# Altium project DARKYDEN.PrjPcb (part 3 of 9)

## Sheet WIFI.SchDoc: DARKYDEN_WIFI
size Letter; ApprovedBy: APPROUVÉ PAR; Author: Harold Malbrouck; Organization: Cegep Limoilou; Address1: 1300, 8e Avenue; Address2: Québec, QC; Address3: Canada; Address4: G1J 5L5; Revision: Rev.A; SheetNumber: 10; SheetTotal: 22
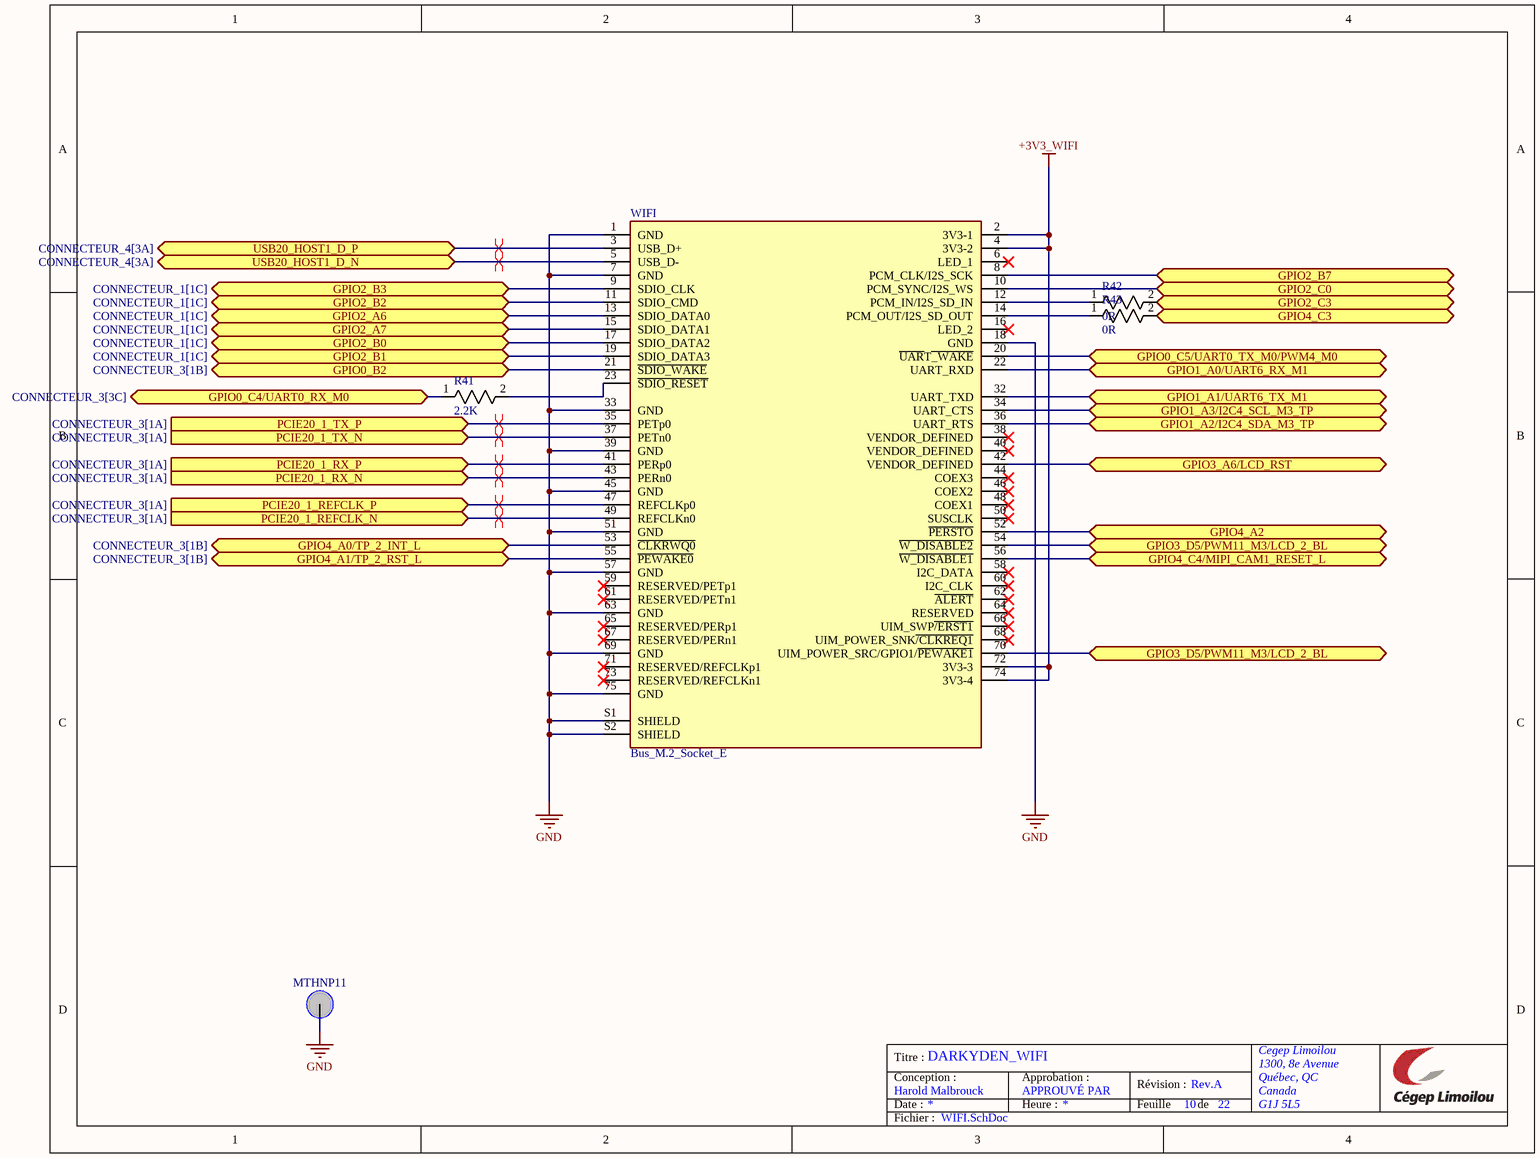
[diagram p3: WIFI.SchDoc]

### Parts
MTHNP11  Mounting Hole Non-Plated 3.2mm  [MTHNP3P2MM]  (value not drawn)
R41  2.2K  [RESC1608X55N]
R42  0R  [RESC1608X55N]
R43  0R  [RESC1608X55N]
WIFI  Bus_M.2_Socket_E  [AMPHENOL_MDT320E01001]

### Ports
GPIO0_B2 (bidir, see CONNECTEUR_3[1B]), GPIO0_C4/UART0_RX_M0 (bidir, see CONNECTEUR_3[3C]), GPIO0_C5/UART0_TX_M0/PWM4_M0 (bidir, see CONNECTEUR_3[3C]), GPIO1_A0/UART6_RX_M1 (bidir, see CONNECTEUR_3[1C]), GPIO1_A1/UART6_TX_M1 (bidir, see CONNECTEUR_3[1C]), GPIO1_A2/I2C4_SDA_M3_TP (bidir, see CONNECTEUR_3[1C]), GPIO1_A3/I2C4_SCL_M3_TP (bidir, see CONNECTEUR_3[1C]), GPIO2_A6 (bidir, see CONNECTEUR_1[1C]), GPIO2_A7 (bidir, see CONNECTEUR_1[1C]), GPIO2_B0 (bidir, see CONNECTEUR_1[1C]), GPIO2_B1 (bidir, see CONNECTEUR_1[1C]), GPIO2_B2 (bidir, see CONNECTEUR_1[1C]), GPIO2_B3 (bidir, see CONNECTEUR_1[1C]), GPIO2_B7 (bidir, see CONNECTEUR_1[1D]), GPIO2_C0 (bidir, see CONNECTEUR_1[1B]), GPIO2_C3 (bidir, see CONNECTEUR_1[1B]), GPIO3_A6/LCD_RST (bidir, see CONNECTEUR_4[1C]), GPIO3_D5/PWM11_M3/LCD_2_BL (bidir, see CONNECTEUR_4[1C], WIFI[3B]), GPIO3_D5/PWM11_M3/LCD_2_BL (bidir, see CONNECTEUR_4[1C], WIFI[3C]), GPIO4_A0/TP_2_INT_L (bidir, see CONNECTEUR_3[1B]), GPIO4_A1/TP_2_RST_L (bidir, see CONNECTEUR_3[1B]), GPIO4_A2 (bidir, see CONNECTEUR_3[1B]), GPIO4_C3 (bidir, see CONNECTEUR_1[3B]), GPIO4_C4/MIPI_CAM1_RESET_L (bidir, see CONNECTEUR_1[3B]), PCIE20_1_REFCLK_N (in, see CONNECTEUR_3[1A]), PCIE20_1_REFCLK_P (in, see CONNECTEUR_3[1A]), PCIE20_1_RX_N (in, see CONNECTEUR_3[1A]), PCIE20_1_RX_P (in, see CONNECTEUR_3[1A]), PCIE20_1_TX_N (in, see CONNECTEUR_3[1A]), PCIE20_1_TX_P (in, see CONNECTEUR_3[1A]), USB20_HOST1_D_N (bidir, see CONNECTEUR_4[3A]), USB20_HOST1_D_P (bidir, see CONNECTEUR_4[3A])

### Nets
+3V3_WIFI: WIFI.2(3V3-1) WIFI.4(3V3-2) WIFI.72(3V3-3) WIFI.74(3V3-4)
GND: MTHNP11.1 WIFI.1(GND) WIFI.7(GND) WIFI.18(GND) WIFI.33(GND) WIFI.39(GND) WIFI.45(GND) WIFI.51(GND) WIFI.57(GND) WIFI.63(GND) WIFI.69(GND) WIFI.75(GND) WIFI.S1(SHIELD) WIFI.S2(SHIELD)  [project net AGND]
GPIO0_B2: WIFI.21(~{SDIO_WAKE}) ; port GPIO0_B2
GPIO0_C4/UART0_RX_M0: R41.1 ; port GPIO0_C4/UART0_RX_M0
GPIO0_C5/UART0_TX_M0/PWM4_M0: WIFI.20(~{UAR}T~{_WAKE}) ; port GPIO0_C5/UART0_TX_M0/PWM4_M0
GPIO1_A0/UART6_RX_M1: WIFI.22(UART_RXD) ; port GPIO1_A0/UART6_RX_M1
GPIO1_A1/UART6_TX_M1: WIFI.32(UART_TXD) ; port GPIO1_A1/UART6_TX_M1
GPIO1_A2/I2C4_SDA_M3_TP: WIFI.36(UART_RTS) ; port GPIO1_A2/I2C4_SDA_M3_TP
GPIO1_A3/I2C4_SCL_M3_TP: WIFI.34(UART_CTS) ; port GPIO1_A3/I2C4_SCL_M3_TP
GPIO2_A6: WIFI.13(SDIO_DATA0) ; port GPIO2_A6
GPIO2_A7: WIFI.15(SDIO_DATA1) ; port GPIO2_A7
GPIO2_B0: WIFI.17(SDIO_DATA2) ; port GPIO2_B0
GPIO2_B1: WIFI.19(SDIO_DATA3) ; port GPIO2_B1
GPIO2_B2: WIFI.11(SDIO_CMD) ; port GPIO2_B2
GPIO2_B3: WIFI.9(SDIO_CLK) ; port GPIO2_B3
GPIO2_B7: WIFI.8(PCM_CLK/I2S_SCK) ; port GPIO2_B7
GPIO2_C0: WIFI.10(PCM_SYNC/I2S_WS) ; port GPIO2_C0
GPIO2_C3: R42.2 ; port GPIO2_C3
GPIO3_A6/LCD_RST: WIFI.42(VENDOR_DEFINED) ; port GPIO3_A6/LCD_RST
GPIO3_D5/PWM11_M3/LCD_2_BL: WIFI.54(~{W_DISABLE2}) WIFI.70(UIM_POWER_SRC/GPIO1/~{PEWAKE1}) ; port GPIO3_D5/PWM11_M3/LCD_2_BL
GPIO4_A0/TP_2_INT_L: WIFI.53(~{CLKRWQ0}) ; port GPIO4_A0/TP_2_INT_L
GPIO4_A1/TP_2_RST_L: WIFI.55(~{PEWAKE0}) ; port GPIO4_A1/TP_2_RST_L
GPIO4_A2: WIFI.52(~{PERSTO}) ; port GPIO4_A2
GPIO4_C3: R43.2 ; port GPIO4_C3
GPIO4_C4/MIPI_CAM1_RESET_L: WIFI.56(~{W_DISABLE1}) ; port GPIO4_C4/MIPI_CAM1_RESET_L
PCIE20_1_REFCLK_N: WIFI.49(REFCLKn0) ; port PCIE20_1_REFCLK_N
PCIE20_1_REFCLK_P: WIFI.47(REFCLKp0) ; port PCIE20_1_REFCLK_P
PCIE20_1_RX_N: WIFI.43(PERn0) ; port PCIE20_1_RX_N
PCIE20_1_RX_P: WIFI.41(PERp0) ; port PCIE20_1_RX_P
PCIE20_1_TX_N: WIFI.37(PETn0) ; port PCIE20_1_TX_N
PCIE20_1_TX_P: WIFI.35(PETp0) ; port PCIE20_1_TX_P
USB20_HOST1_D_N: WIFI.5(USB_D-) ; port USB20_HOST1_D_N
USB20_HOST1_D_P: WIFI.3(USB_D+) ; port USB20_HOST1_D_P
NetR41_2: R41.2 WIFI.23(~{SDIO_RESET})
NetR42_1: R42.1 WIFI.12(PCM_IN/I2S_SD_IN)
NetR43_1: R43.1 WIFI.14(PCM_OUT/I2S_SD_OUT)

Not connected (* = marked no-connect by the designer): WIFI 6(LED_1)* 16(LED_2)* 38(VENDOR_DEFINED)* 40(VENDOR_DEFINED)* 44(COEX3)* 46(COEX2)* 48(COEX1)* 50(SUSCLK)* 58(I2C_DATA)* 59(RESERVED/PETp1)* 60(I2C_CLK)* 61(RESERVED/PETn1)* 62(~{ALERT})* 64(RESERVED)* 65(RESERVED/PERp1)* 66(UIM_SWP~{/ERST1})* 67(RESERVED/PERn1)* 68(UIM_POWER_SNK~{/CLKREQ1})* 71(RESERVED/REFCLKp1)* 73(RESERVED/REFCLKn1)*

### Layout directives
differential pair: PCIE20_1_REFCLK_N, PCIE20_1_REFCLK_P, PCIE20_1_RX_N, PCIE20_1_RX_P, PCIE20_1_TX_N, PCIE20_1_TX_P, USB20_HOST1_D_N, USB20_HOST1_D_P

### Notes on the sheet
- Titre :
- Conception :
- Date :
- Approbation :
- Heure :
- Révision :
- Feuille
- de
- Fichier :

### Library data of the parts
MTHNP11 = MTHNP3P2MM: Mounting Hole Non-Plated 3.2mm drill hole
R41 = ERJ-3GEYJ222V: 2.2 kOhm, ï¿½ 5%, 100 mW, 0603 [1608 Metric], Thick Film, General Purpose; Manufacturer_Name: Panasonic; Value: 2.2kR; Power Rating: 100mW; Voltage Rating: 75V; Temperature Coefficient: 200ppm/°C; Voltage Rating (DC): 50V; Datasheet Link: http://docs-europe.electrocomponents.com/webdocs/13ba/0900766b813ba21b.pdf; Height: 0.55mm; Manufacturer_Part_Number: ERJ-3GEYJ222V; Mouser Part Number: 667-ERJ-3GEYJ222V; Mouser Price/Stock: https://www.mouser.co.uk/ProductDetail/Panasonic/ERJ-3GEYJ222V?qs=4WZYzuGhm5pzxkuuO4fqIg%3D%3D; Arrow Part Number: ERJ-3GEYJ222V; Arrow Price/Stock: https://www.arrow.com/en/products/erj-3geyj222v/panasonic?region=nac; Supplier: Digikey; Supplier Part Number: P2.2KGCT-ND; Manufacturer: Panasonic; Manufacturer Part Number: ERJ-3GEYJ222V; RoHS: Yes; Category: Chip SMD Resistors; Stock: 308618; Pricing: 1=0.1, 10=0.033, 50=0.02, 100=0.0165, 500=0.01096, 1000=0.00939 (USD); Mounting Technology: Surface Mount; Case/Package: 0603; Case Code (Imperial): 0603; Case Code (Metric): 1608; Contact Plating: Tin; Min Operating Temperature: -55°C; Max Operating Temperature: 155°C; Package Quantity: 1; Packaging: Tape and Reel; Tolerance: 5%; Resistor Type: Thick Film; Number of Terminations: 2; Termination: SMD/SMT; Max Power Dissipation: 100mW; Working Voltage: 75V; Features: Automotive AEC-Q200; Series: ERJ; Resistance Tolerance: 5%; Construction: Rectangular; Technology: THICK FILM; Length: 1.6mm; Width: 0.8mm; Depth: 0.8mm; Radiation Hardening: No; Reach SVHC Compliant: No; Military Standard: Not; Lead Free: Lead Free; RoHS Compliant: Yes; ComponentLink1URL: https://datasheet.ciiva.com/11821/0900766b80f806dd-11821453.pdf?src-supplier=Rs; ComponentLink1Description: https://datasheet.ciiva.com/11821/0900766b80f806dd-11821453.pdf?src-supplier=Rs; ComponentLink2URL: https://datasheet.ciiva.com/34303/1988639-34303614.pdf?src-supplier=Jameco; ComponentLink2Description: https://datasheet.ciiva.com/34303/1988639-34303614.pdf?src-supplier=Jameco; ComponentLink3URL: https://datasheet.ciiva.com/22758/1500035-22758223.pdf?src-supplier=Farnell; ComponentLink3Description: https://datasheet.ciiva.com/22758/1500035-22758223.pdf?src-supplier=Farnell; ComponentLink4URL: https://datasheet.ciiva.com/9117/aoa0000ce1-9117127.pdf?src-supplier=Avnet; ComponentLink4Description: https://datasheet.ciiva.com/9117/aoa0000ce1-9117127.pdf?src-supplier=Avnet; ComponentLink5URL: https://datasheet.ciiva.com/28584/1678796-28584095.pdf?src-supplier=Element14; ComponentLink5Description: https://datasheet.ciiva.com/28584/1678796-28584095.pdf?src-supplier=Element14; ComponentLink6URL: https://datasheet.ciiva.com/46380/1500035-46380411.pdf?src-supplier=Element14; ComponentLink6Description: https://datasheet.ciiva.com/46380/1500035-46380411.pdf?src-supplier=Element14; ComponentLink7URL: https://datasheet.ciiva.com/16760/70255313-16760341.pdf?src-supplier=Allied+Electronics; ComponentLink7Description: https://datasheet.ciiva.com/16760/70255313-16760341.pdf?src-supplier=Allied+Electronics; ComponentLink8URL: https://datasheet.ciiva.com/16765/70255313-16765244.pdf?src-supplier=Allied+Electronics; ComponentLink8Description: https://datasheet.ciiva.com/16765/70255313-16765244.pdf?src-supplier=Allied+Electronics; ComponentLink9URL: https://datasheet.ciiva.com/16199/aoa0000ce1-16199902.pdf?src-supplier=Future+Electronics; ComponentLink9Description: https://datasheet.ciiva.com/16199/aoa0000ce1-16199902.pdf?src-supplier=Future+Electronics
R42 R43 = ERJ-3GEY0R00V: Zero Ohm Resistor, Jumper, 0603 [1608 Metric], Thick Film, 100 mW, 1 A, Surface Mount; Manufacturer_Name: Panasonic; Power Rating: 100mW; Voltage Rating: 75V; Tolerance: 0%; Temperature Coefficient: 200ppm/°C; Datasheet Link: http://docs-europe.electrocomponents.com/webdocs/13ba/0900766b813ba21b.pdf; Height: 0.55mm; Manufacturer_Part_Number: ERJ-3GEY0R00V; Mouser Part Number: 667-ERJ-3GEY0R00V; Mouser Price/Stock: https://www.mouser.co.uk/ProductDetail/Panasonic/ERJ-3GEY0R00V?qs=66DK8nO8gJALIOqOWgiVwg%3D%3D; Arrow Part Number: ERJ-3GEY0R00V; Arrow Price/Stock: https://www.arrow.com/en/products/erj3gey0r00v/panasonic?region=europe; Supplier: Digikey; Supplier Part Number: P0.0GCT-ND; Manufacturer: Panasonic; Manufacturer Part Number: ERJ-3GEY0R00V; RoHS: Yes; Category: Chip SMD Resistors; Stock: 766631; Pricing: 1=0.1, 10=0.02, 25=0.0164, 50=0.0144, 100=0.0126, 250=0.0106, 500=0.00936, 1000=0.0083 (USD); Mounting Technology: Surface Mount; Case/Package: 0603; Case Code (Metric): 1608; Case Code (Imperial): 0603; Contact Plating: Tin; Min Operating Temperature: -55°C; Max Operating Temperature: 155°C; Packaging: Tape and Reel; Package Quantity: 5000; Value: 0R; Resistor Type: Thick Film; Number of Terminations: 2; Termination: SMD/SMT; Max Power Dissipation: 100mW; Features: Automotive AEC-Q200; Series: ERJ; Construction: Rectangular; Technology: THICK FILM; Length: 1.6mm; Width: 0.8mm; Depth: 0.8mm; Ratings: AEC-Q200; Radiation Hardening: No; Reach SVHC Compliant: No; Military Standard: Not; RoHS Compliant: Yes; Lead Free: 5697LeadFree; ComponentLink1URL: https://datasheet.ciiva.com/11808/0900766b80f806dd-11808207.pdf?src-supplier=Rs; ComponentLink1Description: https://datasheet.ciiva.com/11808/0900766b80f806dd-11808207.pdf?src-supplier=Rs; ComponentLink2URL: https://datasheet.ciiva.com/27055/1935748-27055113.pdf?src-supplier=Jameco; ComponentLink2Description: https://datasheet.ciiva.com/27055/1935748-27055113.pdf?src-supplier=Jameco; ComponentLink3URL: https://datasheet.ciiva.com/5959/1678796-5959707.pdf?src-supplier=Farnell; ComponentLink3Description: https://datasheet.ciiva.com/5959/1678796-5959707.pdf?src-supplier=Farnell; ComponentLink4URL: https://datasheet.ciiva.com/43460/1678796-43460647.pdf?src-supplier=Farnell; ComponentLink4Description: https://datasheet.ciiva.com/43460/1678796-43460647.pdf?src-supplier=Farnell; ComponentLink5URL: https://datasheet.ciiva.com/48532/aoa0000ce1-48532165.pdf?src-supplier=Avnet; ComponentLink5Description: https://datasheet.ciiva.com/48532/aoa0000ce1-48532165.pdf?src-supplier=Avnet; ComponentLink6URL: https://datasheet.ciiva.com/28695/1678796-28695833.pdf?src-supplier=Element14; ComponentLink6Description: https://datasheet.ciiva.com/28695/1678796-28695833.pdf?src-supplier=Element14; ComponentLink7URL: https://datasheet.ciiva.com/16834/aoa0000ce1-16834828.pdf?src-supplier=Future+Electronics; ComponentLink7Description: https://datasheet.ciiva.com/16834/aoa0000ce1-16834828.pdf?src-supplier=Future+Electronics; ComponentLink8URL: https://datasheet.ciiva.com/16758/70255313-16758527.pdf?src-supplier=Allied+Electronics; ComponentLink8Description: https://datasheet.ciiva.com/16758/70255313-16758527.pdf?src-supplier=Allied+Electronics; ComponentLink9URL: https://datasheet.ciiva.com/30199/4aoa0000ce1-30199822.pdf?src-supplier=Onlinecomponents.com; ComponentLink9Description: https://datasheet.ciiva.com/30199/4aoa0000ce1-30199822.pdf?src-supplier=Onlinecomponents.com; ComponentLink10URL: https://datasheet.ciiva.com/46377/1678796-46377868.pdf?src-supplier=Element14; ComponentLink10Description: https://datasheet.ciiva.com/46377/1678796-46377868.pdf?src-supplier=Element14; ComponentLink11URL: https://datasheet.ciiva.com/9198/aoa0000ce1-9198975.pdf?src-supplier=Avnet; ComponentLink11Description: https://datasheet.ciiva.com/9198/aoa0000ce1-9198975.pdf?src-supplier=Avnet
WIFI = Bus_M.2_Socket_E: PCIe M.2 Connectors, Storage and Server Connector, P=0.5mm, H=3.2mm, Key E,30Î¼in Au Plating; MP: MDT320E01001; MF: Amphenol ICC; Package: None; SnapEDA_Link: https://www.snapeda.com/parts/MDT320E01001/Amphenol+FCI/view-part/?ref=snap; Value: *; Purchase-URL: https://pricing.snapeda.com/search/part/MDT320E01001/?ref=eda; Check_prices: https://www.snapeda.com/parts/MDT320E01001/Amphenol+FCI/view-part/?ref=eda; Availability: In Stock; Price: None

## Sheet CONNECTEUR_2.SchDoc: DARKYDEN_CONNECTEUR_2
size Letter; ApprovedBy: APPROUVÉ PAR; Author: Harold Malbrouck; Organization: Cegep Limoilou; Address1: 1300, 8e Avenue; Address2: Québec, QC; Address3: Canada; Address4: G1J 5L5; Revision: Rev.B; SheetNumber: 12; SheetTotal: 22
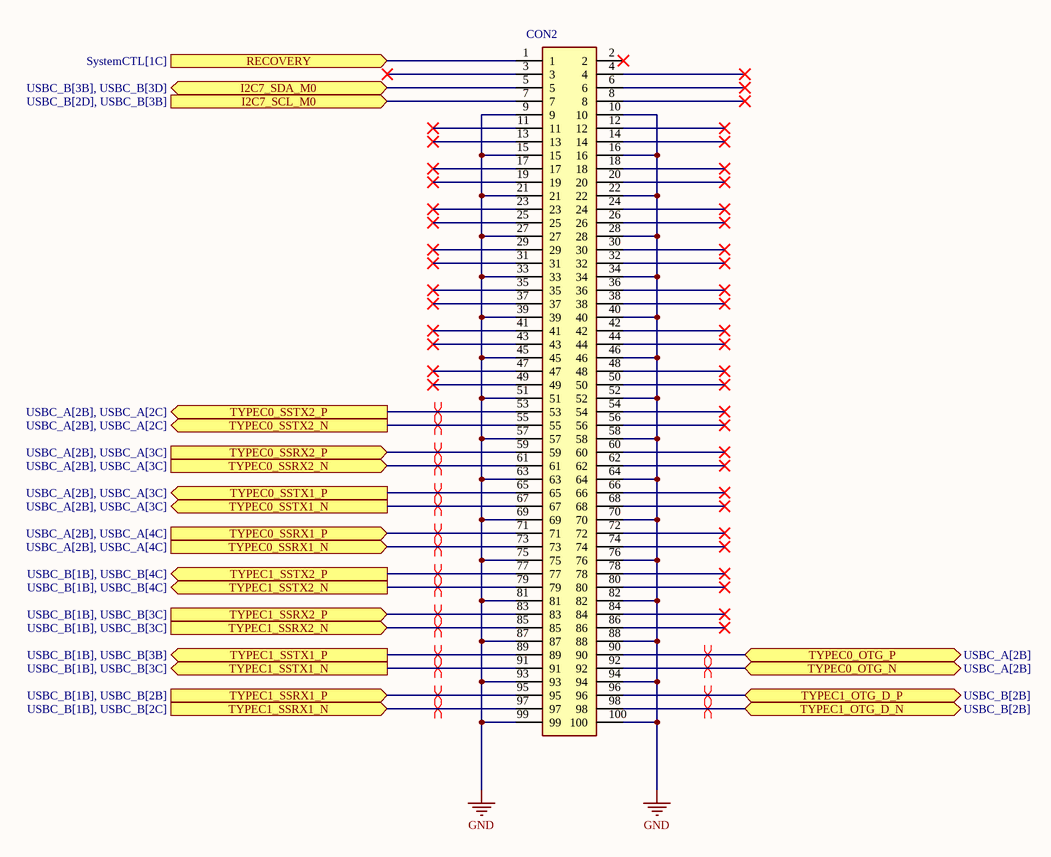
[diagram p4: CONNECTEUR_2.SchDoc]

### Parts
CON2  DF40HC  [DF40HC30100DS04V51_MOD]  (value not drawn)

### Ports
I2C7_SCL_M0 (in, see USBC_B[2D], USBC_B[3B]), I2C7_SDA_M0 (bidir, see USBC_B[3B], USBC_B[3D]), RECOVERY (in, see SystemCTL[1C]), TYPEC0_OTG_N (bidir, see USBC_A[2B]), TYPEC0_OTG_P (bidir, see USBC_A[2B]), TYPEC0_SSRX1_N (in, see USBC_A[2B], USBC_A[4C]), TYPEC0_SSRX1_P (in, see USBC_A[2B], USBC_A[4C]), TYPEC0_SSRX2_N (in, see USBC_A[2B], USBC_A[3C]), TYPEC0_SSRX2_P (in, see USBC_A[2B], USBC_A[3C]), TYPEC0_SSTX1_N (out, see USBC_A[2B], USBC_A[3C]), TYPEC0_SSTX1_P (out, see USBC_A[2B], USBC_A[3C]), TYPEC0_SSTX2_N (out, see USBC_A[2B], USBC_A[2C]), TYPEC0_SSTX2_P (out, see USBC_A[2B], USBC_A[2C]), TYPEC1_OTG_D_N (bidir, see USBC_B[2B]), TYPEC1_OTG_D_P (bidir, see USBC_B[2B]), TYPEC1_SSRX1_N (in, see USBC_B[1B], USBC_B[2C]), TYPEC1_SSRX1_P (in, see USBC_B[1B], USBC_B[2B]), TYPEC1_SSRX2_N (in, see USBC_B[1B], USBC_B[3C]), TYPEC1_SSRX2_P (in, see USBC_B[1B], USBC_B[3C]), TYPEC1_SSTX1_N (out, see USBC_B[1B], USBC_B[3C]), TYPEC1_SSTX1_P (out, see USBC_B[1B], USBC_B[3B]), TYPEC1_SSTX2_N (out, see USBC_B[1B], USBC_B[4C]), TYPEC1_SSTX2_P (out, see USBC_B[1B], USBC_B[4C])

### Nets
GND: CON2.9 CON2.10 CON2.15 CON2.16 CON2.21 CON2.22 CON2.27 CON2.28 CON2.33 CON2.34 CON2.39 CON2.40 CON2.45 CON2.46 CON2.51 CON2.52 CON2.57 CON2.58 CON2.63 CON2.64 CON2.69 CON2.70 CON2.75 CON2.76 CON2.81 CON2.82 CON2.87 CON2.88 CON2.93 CON2.94 CON2.99 CON2.100  [project net AGND]
I2C7_SCL_M0: CON2.7 ; port I2C7_SCL_M0
I2C7_SDA_M0: CON2.5 ; port I2C7_SDA_M0
RECOVERY: CON2.1 ; port RECOVERY
TYPEC0_OTG_N: CON2.92 ; port TYPEC0_OTG_N
TYPEC0_OTG_P: CON2.90 ; port TYPEC0_OTG_P
TYPEC0_SSRX1_N: CON2.73 ; port TYPEC0_SSRX1_N
TYPEC0_SSRX1_P: CON2.71 ; port TYPEC0_SSRX1_P
TYPEC0_SSRX2_N: CON2.61 ; port TYPEC0_SSRX2_N
TYPEC0_SSRX2_P: CON2.59 ; port TYPEC0_SSRX2_P
TYPEC0_SSTX1_N: CON2.67 ; port TYPEC0_SSTX1_N
TYPEC0_SSTX1_P: CON2.65 ; port TYPEC0_SSTX1_P
TYPEC0_SSTX2_N: CON2.55 ; port TYPEC0_SSTX2_N
TYPEC0_SSTX2_P: CON2.53 ; port TYPEC0_SSTX2_P
TYPEC1_OTG_D_N: CON2.98 ; port TYPEC1_OTG_D_N
TYPEC1_OTG_D_P: CON2.96 ; port TYPEC1_OTG_D_P
TYPEC1_SSRX1_N: CON2.97 ; port TYPEC1_SSRX1_N
TYPEC1_SSRX1_P: CON2.95 ; port TYPEC1_SSRX1_P
TYPEC1_SSRX2_N: CON2.85 ; port TYPEC1_SSRX2_N
TYPEC1_SSRX2_P: CON2.83 ; port TYPEC1_SSRX2_P
TYPEC1_SSTX1_N: CON2.91 ; port TYPEC1_SSTX1_N
TYPEC1_SSTX1_P: CON2.89 ; port TYPEC1_SSTX1_P
TYPEC1_SSTX2_N: CON2.79 ; port TYPEC1_SSTX2_N
TYPEC1_SSTX2_P: CON2.77 ; port TYPEC1_SSTX2_P

Not connected (* = marked no-connect by the designer): CON2 2* 3* 4* 6* 8* 11* 12* 13* 14* 17* 18* 19* 20* 23* 24* 25* 26* 29* 30* 31* 32* 35* 36* 37* 38* 41* 42* 43* 44* 47* 48* 49* 50* 54* 56* 60* 62* 66* 68* 72* 74* 78* 80* 84* 86*

### Layout directives
differential pair: TYPEC0_OTG_N, TYPEC0_OTG_P, TYPEC0_SSRX1_N, TYPEC0_SSRX1_P, TYPEC0_SSRX2_N, TYPEC0_SSRX2_P, TYPEC0_SSTX1_N, TYPEC0_SSTX1_P, TYPEC0_SSTX2_N, TYPEC0_SSTX2_P, TYPEC1_OTG_D_N, TYPEC1_OTG_D_P, TYPEC1_SSRX1_N, TYPEC1_SSRX1_P, TYPEC1_SSRX2_N, TYPEC1_SSRX2_P, TYPEC1_SSTX1_N, TYPEC1_SSTX1_P, TYPEC1_SSTX2_N, TYPEC1_SSTX2_P

### Notes on the sheet
- Titre :
- Conception :
- Date :
- Approbation :
- Heure :
- Révision :
- Feuille
- de
- Fichier :

### Library data of the parts
CON2 = DF40HC(3.0)-100DS-0.4V(51): Stacking Board Connector, DF40 Series, Receptacle, 0.4 mm, 100, Surface Mount, G; Manufacturer_Name: Hirose; Number of Positions: 100; Contact Resistance: 90mR; Contact Voltage Rating (AC): 30V; Current Rating: 300mA; Mated Stacking Heights: 3mm; Contact Pitch: 400um; Datasheet Link: https://componentsearchengine.com/Datasheets/1/DF40HC(3.0)-100DS-0.4V(51.pdf; Height: 3.05mm; Manufacturer_Part_Number: DF40HC(3.0)-100DS-0.4V(51; Mouser Part Number: 798-DF40HC30100DS451; Mouser Price/Stock: https://www.mouser.co.uk/ProductDetail/Hirose-Connector/DF40HC3.0-100DS-0.4V51?qs=%252BAZVS4b%2FkgIV%252B3vHYy2dCA%3D%3D; Arrow Part Number: DF40HC(3.0)-100DS-0.4V(51; Arrow Price/Stock: https://www.arrow.com/en/products/df40hc-3.0-100ds-0.4v-51/hirose-electric; Supplier: Digikey; Supplier Part Number: 26-DF40HC(3.0)-100DS-0.4V(51)CT-ND; Manufacturer: Hirose; Manufacturer Part Number: DF40HC(3.0)-100DS-0.4V(51; RoHS: Yes; Category: Headers and Wire Housings; Stock: 5604; Pricing: 1=2.61, 10=2.219, 25=2.0796, 50=1.9804, 100=1.8858, 250=1.76764, 500=1.68326, 1000=1.6524 (USD); Mounting Technology: Surface Mount; Contact Plating: Gold; Contact Material: Nickel,Gold; Housing Color: Black; Min Operating Temperature: -35°C; Max Operating Temperature: 85°C; Package Quantity: 3000; Packaging: Tape and Reel; Number of Rows: 2; Connector Type: Receptacle; Series: DF40; Contact Voltage Rating (DC): 30V; Number of Contacts: 100; Orientation: Straight; Voltage Rating: 30V; Length: 22.6mm; Width: 3.38mm; ComponentLink1URL: https://datasheet.ciiva.com/13559/ed-df40-20140305-13559540.pdf?src-supplier=Mouser; ComponentLink1Description: https://datasheet.ciiva.com/13559/ed-df40-20140305-13559540.pdf?src-supplier=Mouser

## Sheet eDP.SchDoc: DARKYDEN_eDP
size Letter; ApprovedBy: APPROUVÉ PAR; Author: Harold Malbrouck; Organization: Cegep Limoilou; Address1: 1300, 8e Avenue; Address2: Québec, QC; Address3: Canada; Address4: G1J 5L5; Revision: Rev.A; SheetNumber: 15; SheetTotal: 22
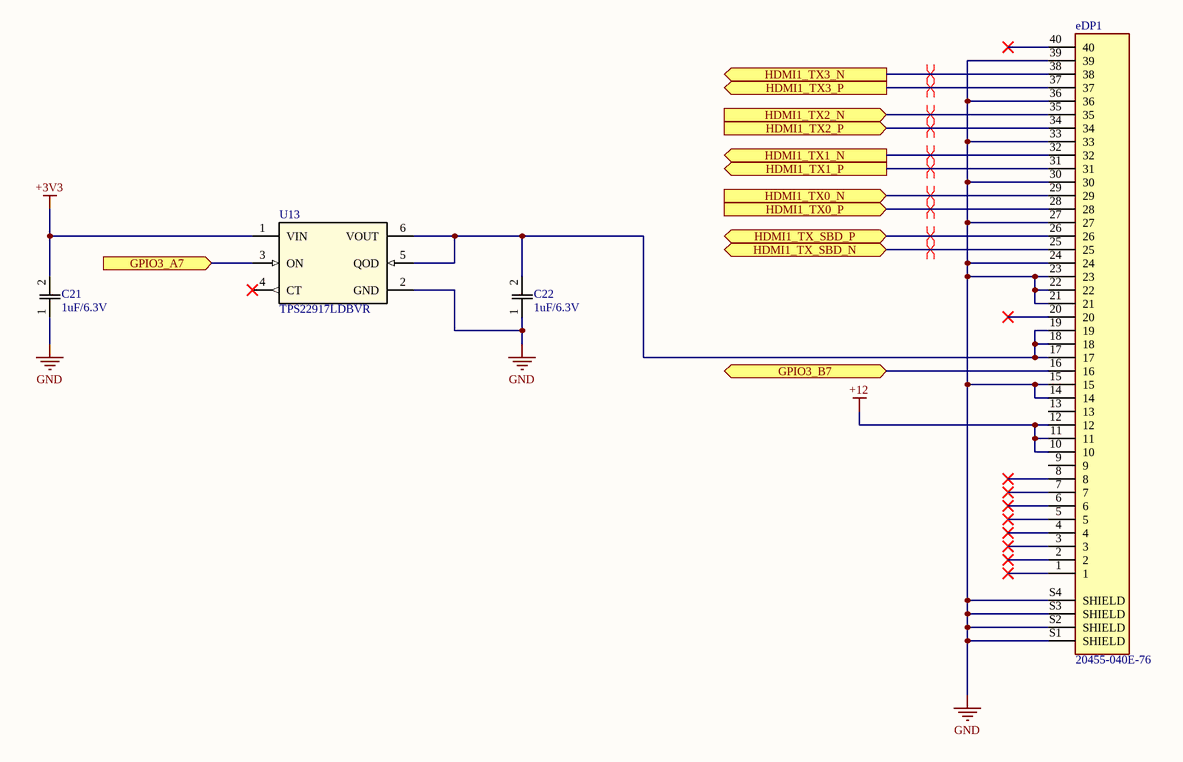
[diagram p5: eDP.SchDoc]

### Parts
C21  1uF/6.3V  [C0805]
C22  1uF/6.3V  [C0805]
eDP1  20455-040E-76  [IPEX_20455-040E-76]
U13  TPS22917LDBVR  [DBV0006_L]

### Ports
GPIO3_A7 (in, see CONNECTEUR_4[3C]), GPIO3_B7 (bidir, see CONNECTEUR_4[3C]), HDMI1_TX0_N (in, see CONNECTEUR_4[1A]), HDMI1_TX0_P (in, see CONNECTEUR_4[1A]), HDMI1_TX1_N (out, see CONNECTEUR_4[1A]), HDMI1_TX1_P (out, see CONNECTEUR_4[1A]), HDMI1_TX2_N (in, see CONNECTEUR_4[1A]), HDMI1_TX2_P (in, see CONNECTEUR_4[1A]), HDMI1_TX3_N (out, see CONNECTEUR_4[1A]), HDMI1_TX3_P (out, see CONNECTEUR_4[1A]), HDMI1_TX_SBD_N (bidir, see CONNECTEUR_4[1B]), HDMI1_TX_SBD_P (bidir, see CONNECTEUR_4[1B])

### Nets
+3V3: C21.2 U13.1(VIN)
+12: eDP1.10 eDP1.11 eDP1.12
GND: C21.1 C22.1 eDP1.14 eDP1.15 eDP1.21 eDP1.22 eDP1.23 eDP1.24 eDP1.27 eDP1.30 eDP1.33 eDP1.36 eDP1.39 eDP1.S1(SHIELD) eDP1.S2(SHIELD) eDP1.S3(SHIELD) eDP1.S4(SHIELD) U13.2(GND)  [project net AGND]
GPIO3_A7: U13.3(ON) ; port GPIO3_A7
GPIO3_B7: eDP1.16 ; port GPIO3_B7
HDMI1_TX0_N: eDP1.29 ; port HDMI1_TX0_N
HDMI1_TX0_P: eDP1.28 ; port HDMI1_TX0_P
HDMI1_TX1_N: eDP1.32 ; port HDMI1_TX1_N
HDMI1_TX1_P: eDP1.31 ; port HDMI1_TX1_P
HDMI1_TX2_N: eDP1.35 ; port HDMI1_TX2_N
HDMI1_TX2_P: eDP1.34 ; port HDMI1_TX2_P
HDMI1_TX3_N: eDP1.38 ; port HDMI1_TX3_N
HDMI1_TX3_P: eDP1.37 ; port HDMI1_TX3_P
HDMI1_TX_SBD_N: eDP1.25 ; port HDMI1_TX_SBD_N
HDMI1_TX_SBD_P: eDP1.26 ; port HDMI1_TX_SBD_P
NetC22_2: C22.2 eDP1.17 eDP1.18 eDP1.19 U13.5(QOD) U13.6(VOUT)

Not connected (* = marked no-connect by the designer): eDP1 1* 2* 3* 4* 5* 6* 7* 8* 9 13 20* 40*; U13 4(CT)*

### Layout directives
differential pair: HDMI1_TX0_N, HDMI1_TX0_P, HDMI1_TX1_N, HDMI1_TX1_P, HDMI1_TX2_N, HDMI1_TX2_P, HDMI1_TX3_N, HDMI1_TX3_P, HDMI1_TX_SBD_N, HDMI1_TX_SBD_P

### Notes on the sheet
- Titre :
- Conception :
- Date :
- Approbation :
- Heure :
- Révision :
- Feuille
- de
- Fichier :

### Library data of the parts
C21 C22 = C0805C105K9RACTU: 1 uF, 6.3 V, ± 10%, X7R, 0805 [2012 Metric] Multilayer Ceramic Capacitor,; Manufacturer_Name: KEMET; Value: 1uF; Voltage Rating: 6.3V; Datasheet Link: https://content.kemet.com/datasheets/KEM_C1002_X7R_SMD.pdf; Height: 1.1mm; Manufacturer_Part_Number: C0805C105K9RACTU; Mouser Part Number: 80-C0805C105K9R; Mouser Price/Stock: https://www.mouser.co.uk/ProductDetail/KEMET/C0805C105K9RACTU?qs=Nnkldhwoc36daYb4WU%2Fecw%3D%3D; Arrow Part Number: C0805C105K9RACTU; Arrow Price/Stock: https://www.arrow.com/en/products/c0805c105k9ractu/kemet-corporation?utm_currency=USD&region=nac; Supplier: Digikey; Supplier Part Number: 399-13161-1-ND; Manufacturer: KEMET; Manufacturer Part Number: C0805C105K9RACTU; RoHS: Yes; Category: Ceramic Capacitors; Stock: 8847; Pricing: 1=0.49, 10=0.397, 100=0.3017, 1000=0.24335, 2500=0.22102, 5000=0.20619, 7500=0.16784, 12500=0.12939, 17500=0.02492, 25000=0.02414, 62500=0.02244, 125000=0.02142, 250000=0.02059 (USD); Mounting Technology: Surface Mount; Case/Package: 0805; Case Code (Metric): 2012; Case Code (Imperial): 0805; Dielectric Material: Ceramic; Min Operating Temperature: -55°C; Max Operating Temperature: 125°C; Packaging: Tape and Reel; Tolerance: 10%; Package Quantity: 4000; Voltage Rating (DC): 6.3V; Dielectric: X7R; Termination: SMD/SMT; Series: C0805C; Construction: Flat; Length: 2mm; Width: 1.2mm; Thickness: 0.039inch; Lead Pitch: 0.75mm; Depth: 1.25mm; Radiation Hardening: No; RoHS Compliant: Yes; ComponentLink1URL: https://datasheet.ciiva.com/5416/kem-c1002-x7r-smd-5416463.pdf?src-supplier=Mouser; ComponentLink1Description: https://datasheet.ciiva.com/5416/kem-c1002-x7r-smd-5416463.pdf?src-supplier=Mouser
eDP1 = 20455-040E-76: Conn Wire to Board RCP 40 POS 0.5mm Solder RA Side Entry SMDCABLINE® T/R; Manufacturer: I-PEX; Package: None; Price: None; Value: *; MP: 20455-040E-76; Availability: Unavailable; Supplier: Digikey; Supplier Part Number: 5378-20455-040E-76CT-ND; Manufacturer Part Number: 20455-040E-76; RoHS: No; Category: FFC / FPC; Stock: 7447; Pricing: 1=2.21, 10=1.878, 25=1.7604, 50=1.6764, 100=1.5962, 250=1.49624, 500=1.4248, 1000=1.377 (USD); RoHS Compliant: No; ComponentLink1URL: https://datasheet.octopart.com/20455-040E-76-I-PEX-datasheet-154856138.pdf?src-supplier=Future+Electronics; ComponentLink1Description: https://datasheet.octopart.com/20455-040E-76-I-PEX-datasheet-154856138.pdf?src-supplier=Future+Electronics; ComponentLink2URL: http://datasheet.octopart.com/20455-040E-76-I-PEX-datasheet-154856138.pdf?src-supplier=Quest; ComponentLink2Description: http://datasheet.octopart.com/20455-040E-76-I-PEX-datasheet-154856138.pdf?src-supplier=Quest
U13 = TPS22917LDBVR: 5.5-V, 2-A, 80-mΩ , 10-nA leakage load switch adj. rise time and adj output discharge 6-SOT-23 -45 to 125; Mfr_Name: Texas Instruments; TYPE: TYPE; RefDes: RefDes; Supplier: Digikey; Supplier Part Number: 296-TPS22917LDBVRCT-ND; Manufacturer: Texas Instruments; Manufacturer Part Number: TPS22917LDBVR; RoHS: No; Category: Integrated Circuits (ICs); Stock: 10229; Pricing: 1=0.41, 10=0.284, 25=0.2528, 100=0.2188, 250=0.20248, 500=0.1927, 1000=0.18463 (USD); Case/Package: 926Case; Pins: 6NUMBER; Length: 2.9mm; Width: 1.6mm; Thickness: 1.2mm

## Sheet POWERSYSTEM.SchDoc: DARKYDEN_POWERSYSTEM
size Letter; ApprovedBy: APPROUVÉ PAR; Author: Harold Malbrouck; Organization: Cegep Limoilou; Address1: 1300, 8e Avenue; Address2: Québec, QC; Address3: Canada; Address4: G1J 5L5; Revision: Rev.A; SheetNumber: 16; SheetTotal: 22
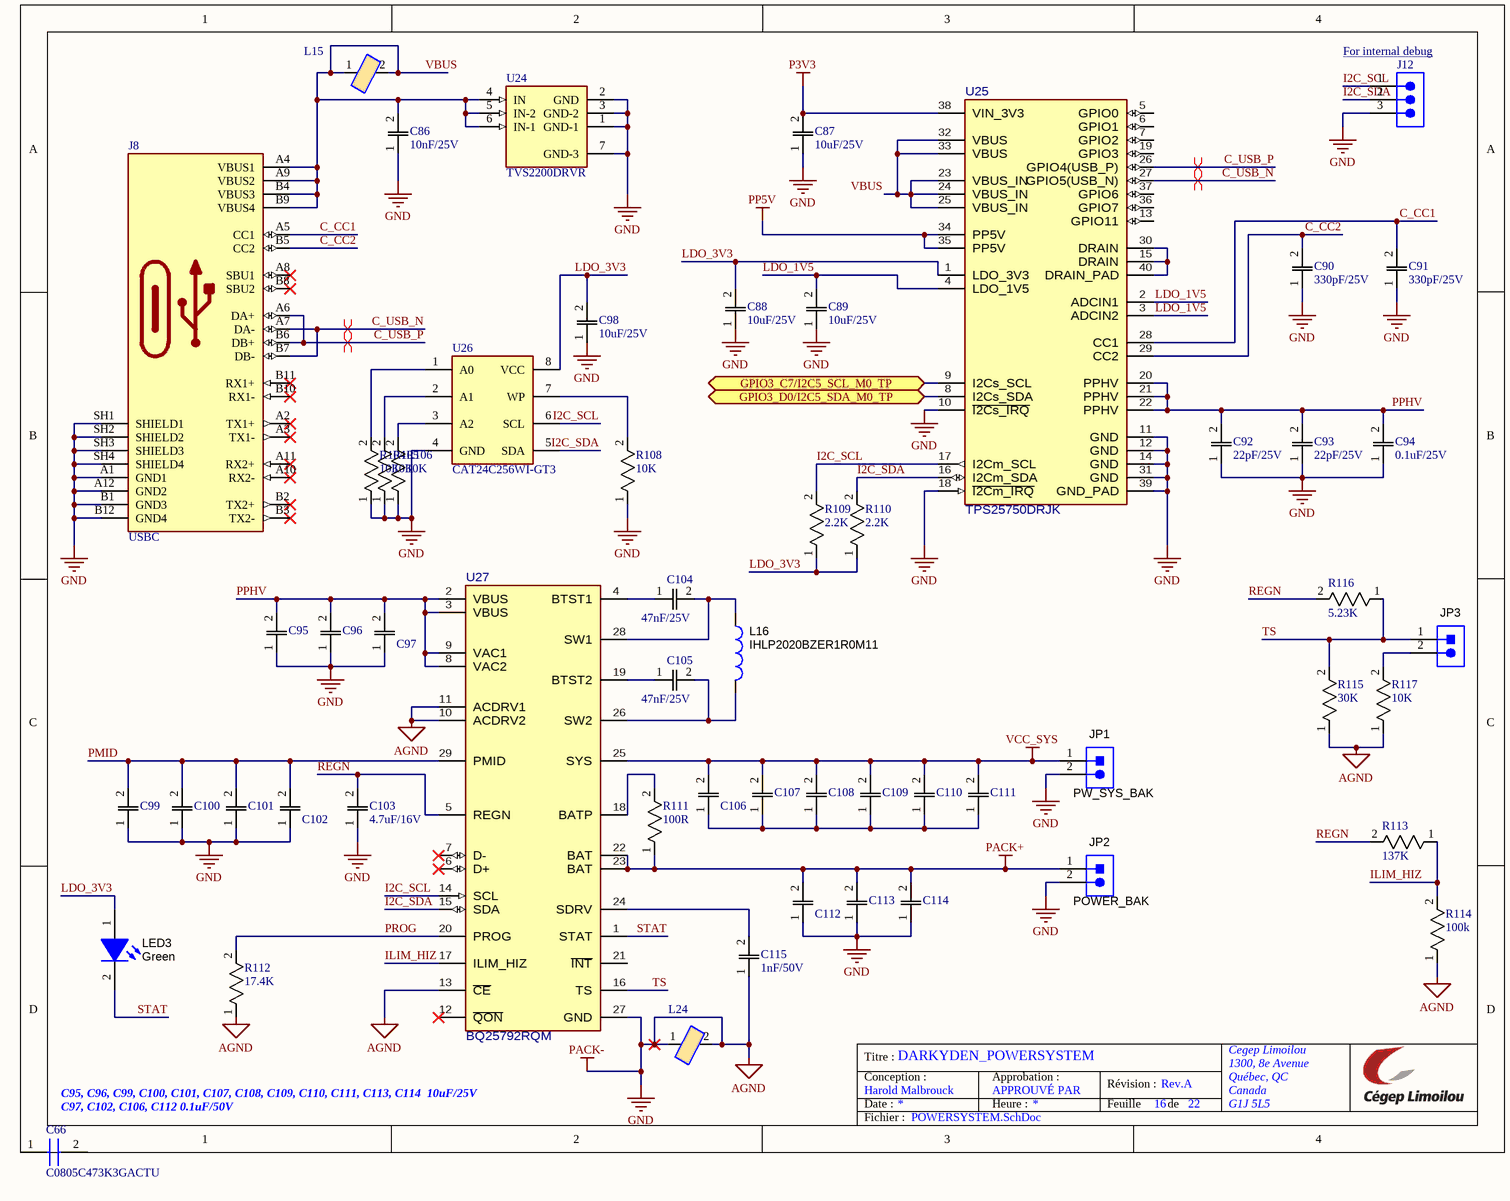
[diagram p6: POWERSYSTEM.SchDoc]

### Parts
C66  C0805C473K3GACTU  [C0805]
C86  10nF/25V  [C0805]
C87  10uF/25V  [C0805]
C88  10uF/25V  [C0805]
C89  10uF/25V  [C0805]
C90  330pF/25V  [C0805]
C91  330pF/25V  [C0805]
C92  22pF/25V  [c0805]
C93  22pF/25V  [c0805]
C94  0.1uF/25V  [c0805]
C95  10uF/25V  [C0805]  (value not drawn)
C96  10uF/25V  [C0805]  (value not drawn)
C97  0.1uF/50V  [C0805]  (value not drawn)
C98  10uF/25V  [C0805]
C99  10uF/25V  [C0805]  (value not drawn)
C100  10uF/25V  [C0805]  (value not drawn)
C101  10uF/25V  [C0805]  (value not drawn)
C102  0.1uF/50V  [C0805]  (value not drawn)
C103  4.7uF/16V  [C0805]
C104  47nF/25V  [C0805]
C105  47nF/25V  [C0805]
C106  0.1uF/50V  [C0805]  (value not drawn)
C107  10uF/25V  [C0805]  (value not drawn)
C108  10uF/25V  [C0805]  (value not drawn)
C109  10uF/25V  [C0805]  (value not drawn)
C110  10uF/25V  [C0805]  (value not drawn)
C111  10uF/25V  [C0805]  (value not drawn)
C112  0.1uF/50V  [C0805]  (value not drawn)
C113  10uF/25V  [C0805]  (value not drawn)
C114  10uF/25V  [C0805]  (value not drawn)
C115  1nF/50V  [C0805]
J8  USBC  [USB_C]
J12  61300311121  [61300311121]  (value not drawn)
JP1  PW_SYS_BAK  [61300211121]
JP2  POWER_BAK  [61300211121]
JP3  TS  [61300211121]  (value not drawn)
L15  FBMJ2125HM210NT  [INDC2012X105N]  (value not drawn)
L16  IHLP2020BZER1R0M11  [IHLP-2020BZ]
L24  FBMJ2125HM210NT  [INDC2012X105N]  (value not drawn)
LED3  value Green  [LED_LTST-C190]  (hidden comment: LTST-C190GKT)
R104  10K  [RESC1608X55N]
R105  10K  [RESC1608X55N]
R106  10K  [RESC1608X55N]
R108  10K  [RESC1608X55N]
R109  2.2K  [RESC1608X55N]
R110  2.2K  [RESC1608X55N]
R111  100R  [RESC1608X55N]
R112  17.4K  [RESC1608X55N]
R113  137K  [RESC1608X55N]
R114  100k  [RESC1608X55N]
R115  30K  [RESC1608X55N]
R116  5.23K  [RESC1608X55N]
R117  10K  [RESC1608X55N]
U24  TVS2200DRVR  [SON65P200X200X80-7N]
U25  TPS25750DRJK  [RJK0038B-C01-MFG]
U26  CAT24C256WI-GT3  [SOIC127P600X175-8N]
U27  BQ25792RQM  [RQM0029A-MFG]

### Ports
GPIO3_C7/I2C5_SCL_M0_TP (bidir, see CONNECTEUR_4[1C]), GPIO3_D0/I2C5_SDA_M0_TP (bidir, see CONNECTEUR_4[1C])

### Nets
AGND: C86.1 C87.1 C88.1 C89.1 C90.1 C91.1 C92.1 C93.1 C94.1 C95.1 C96.1 C97.1 C98.1 C99.1 C100.1 C101.1 C102.1 C103.1 C112.1 C113.1 C114.1 C115.1 J8.A1(GND1) J8.A12(GND2) J8.B1(GND3) J8.B12(GND4) J8.SH1(SHIELD1) J8.SH2(SHIELD2) J8.SH3(SHIELD3) J8.SH4(SHIELD4) J12.3 JP1.2 JP2.2 L24.1 L24.2 R104.1 R105.1 R106.1 R108.1 R112.1 R114.1 R115.1 R117.1 U24.1(GND-1) U24.2(GND) U24.3(GND-2) U24.7(GND-3) U25.10(~{I2Cs_IRQ}) U25.11(GND) U25.12(GND) U25.14(GND) U25.18(~{I2Cm_IRQ}) U25.31(GND) U25.39(GND_PAD) U26.4(GND) U27.10(ACDRV2) U27.11(ACDRV1) U27.13(~{CE}) U27.27(GND)  [also labelled GND, PACK-]
P3V3: C87.2 U25.38(VIN_3V3)
PACK+: C112.2 C113.2 C114.2 JP2.1 R111.1 U27.22(BAT) U27.23(BAT)
PP5V: U25.34(PP5V) U25.35(PP5V)
VCC_SYS: C106.2 C107.2 C108.2 C109.2 C110.2 C111.2 JP1.1 U27.25(SYS)
C_CC1: C91.2 J8.A5(CC1) U25.28(CC1)
C_CC2: C90.2 J8.B5(CC2) U25.29(CC2)
C_USB_N: J8.A7(DA-) J8.B7(DB-) U25.27(GPIO5(USB_N))
C_USB_P: J8.A6(DA+) J8.B6(DB+) U25.26(GPIO4(USB_P))
GPIO3_C7/I2C5_SCL_M0_TP: U25.9(I2Cs_SCL) ; port GPIO3_C7/I2C5_SCL_M0_TP
GPIO3_D0/I2C5_SDA_M0_TP: U25.8(I2Cs_SDA) ; port GPIO3_D0/I2C5_SDA_M0_TP
I2C_SCL: J12.1 R109.2 U25.17(I2Cm_SCL) U26.6(SCL) U27.14(SCL)
I2C_SDA: J12.2 R110.2 U25.16(I2Cm_SDA) U26.5(SDA) U27.15(SDA)
ILIM_HIZ: R113.1 R114.2 U27.17(ILIM_HIZ)
LDO_1V5: C89.2 U25.2(ADCIN1) U25.3(ADCIN2) U25.4(LDO_1V5)
LDO_3V3: C88.2 C98.2 LED3.1(A) R109.1 R110.1 U25.1(LDO_3V3) U26.8(VCC)
PMID: C99.2 C100.2 C101.2 C102.2 U27.29(PMID)
PPHV: C92.2 C93.2 C94.2 C95.2 C96.2 C97.2 U25.20(PPHV) U25.21(PPHV) U25.22(PPHV) U27.2(VBUS) U27.3(VBUS) U27.8(VAC2) U27.9(VAC1)
PROG: R112.2 U27.20(PROG)
REGN: C103.2 R113.2 R116.2 U27.5(REGN)
STAT: LED3.2(K) U27.1(STAT)
TS: JP3.1 R115.2 R116.1 U27.16(TS)
VBUS: C86.2 J8.A4(VBUS1) J8.A9(VBUS2) J8.B4(VBUS3) J8.B9(VBUS4) L15.1 L15.2 U24.4(IN) U24.5(IN-2) U24.6(IN-1) U25.23(VBUS_IN) U25.24(VBUS_IN) U25.25(VBUS_IN) U25.32(VBUS) U25.33(VBUS)
NetC104_1: C104.1 U27.4(BTST1)
NetC104_2: C104.2 L16.1 U27.28(SW1)
NetC105_1: C105.1 U27.19(BTST2)
NetC105_2: C105.2 L16.2 U27.26(SW2)
NetC106_1: C106.1 C107.1 C108.1 C109.1 C110.1 C111.1
NetC115_2: C115.2 U27.24(SDRV)
NetJP3_2: JP3.2 R117.2
NetR104_2: R104.2 U26.1(A0)
NetR105_2: R105.2 U26.2(A1)
NetR106_2: R106.2 U26.3(A2)
NetR108_2: R108.2 U26.7(WP)
NetR111_2: R111.2 U27.18(BATP)
NetU25_15: U25.15(DRAIN) U25.30(DRAIN) U25.40(DRAIN_PAD)

Not connected (* = marked no-connect by the designer): C66 1 2; J8 A2(TX1+)* A3(TX1-)* A8(SBU1)* A10(RX2-)* A11(RX2+)* B2(TX2+)* B3(TX2-)* B8(SBU2)* B10(RX1-)* B11(RX1+)*; U25 5(GPIO0) 6(GPIO1) 7(GPIO2) 13(GPIO11) 19(GPIO3) 36(GPIO7) 37(GPIO6); U27 6(D+)* 7(D-)* 12(~{QON})* 21(~{INT})

### Layout directives
differential pair: C_USB_N, C_USB_P

### Notes on the sheet
- (near J12) For internal debug
- (near C66) C95, C96, C99, C100, C101, C107, C108, C109, C110, C111, C113, C114  10uF/25V
  C97, C102, C106, C112 0.1uF/50V
- Titre :
- Conception :
- Date :
- Approbation :
- Heure :
- Révision :
- Feuille
- de
- Fichier :